# EAGLE design pov_brico (EAGLE 5.11)
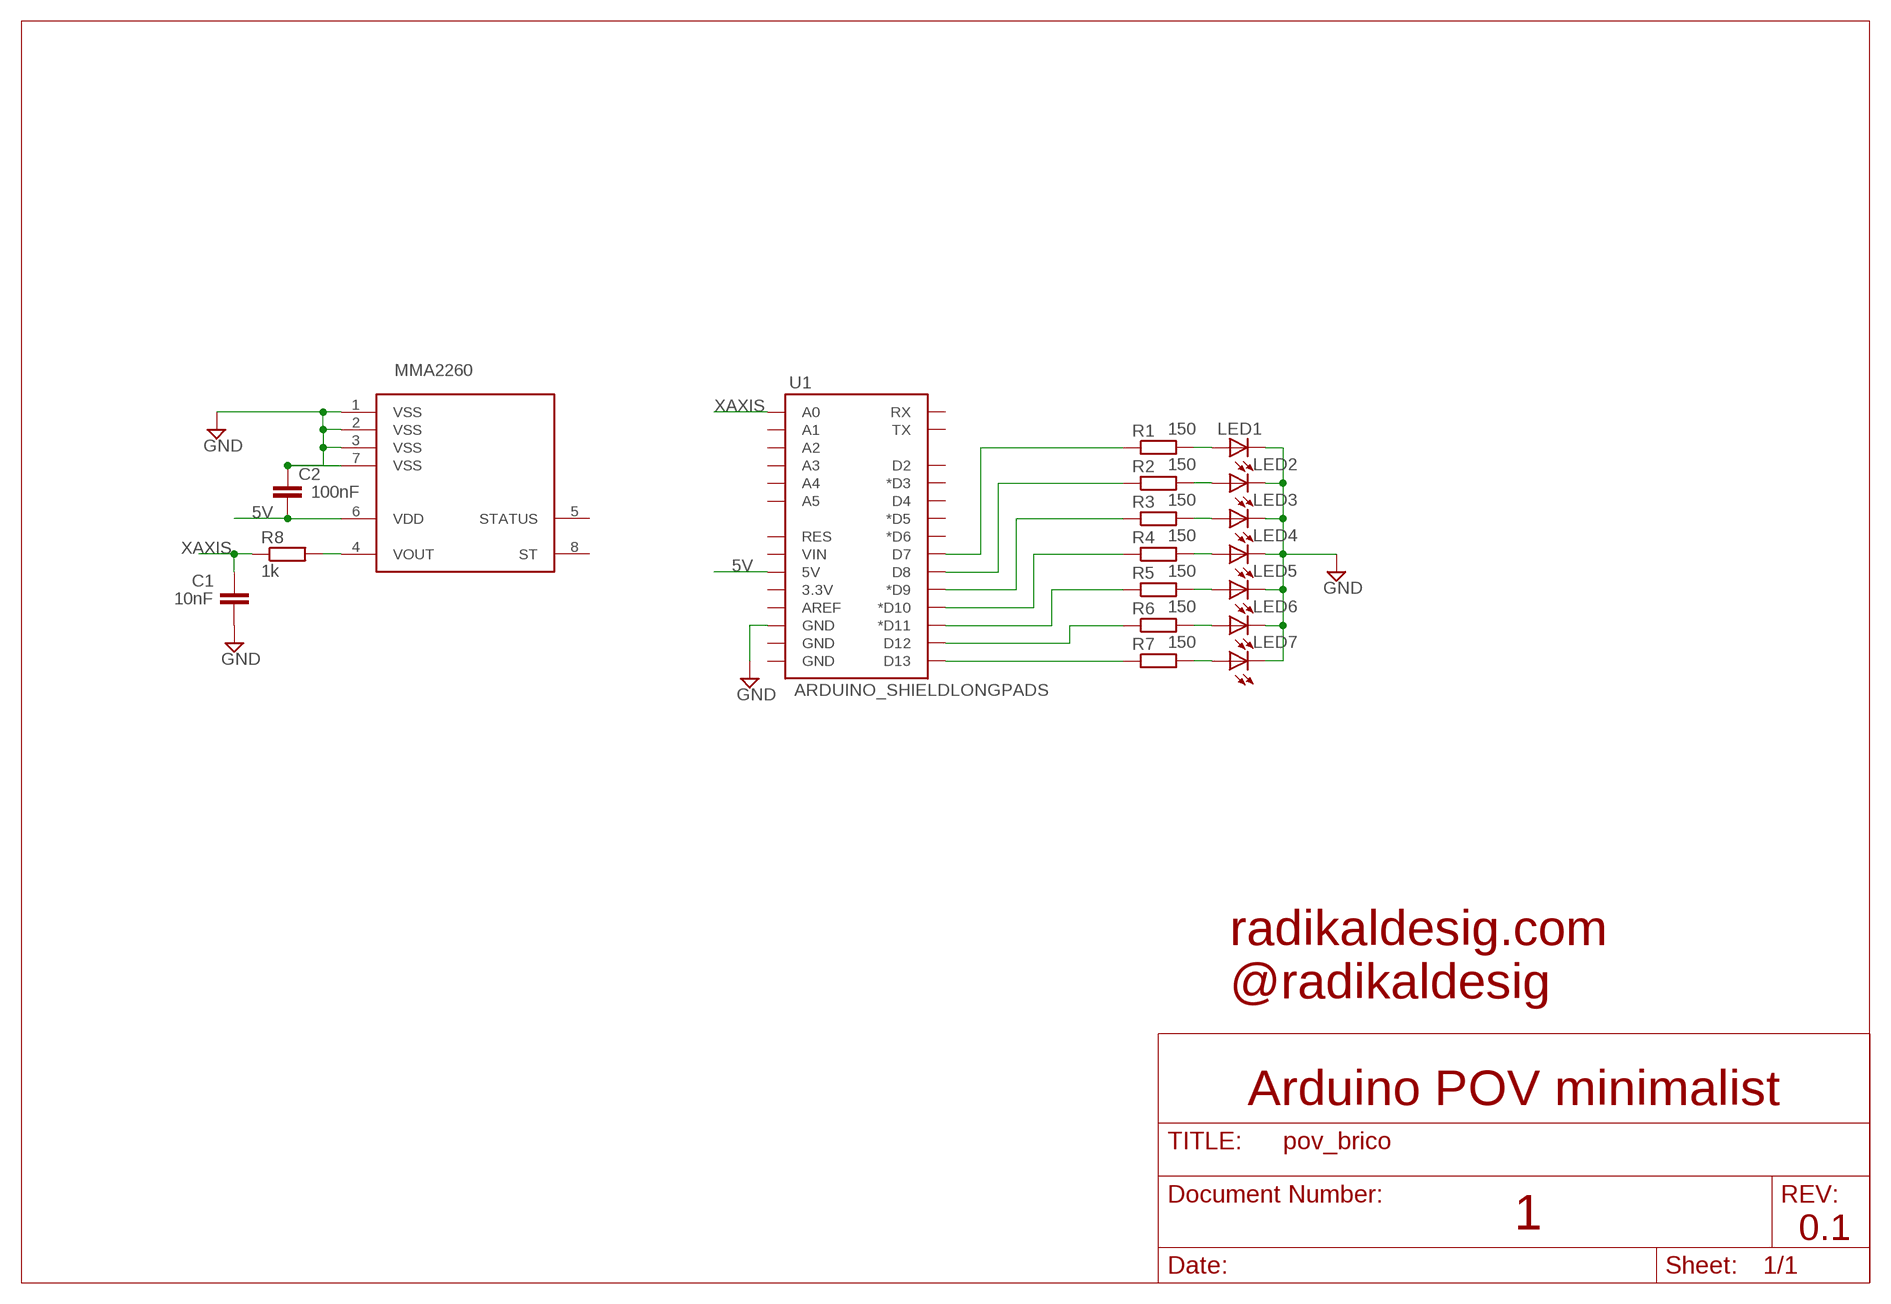
[diagram p0: schematic, sheet 1]

## Parts
C1  10nF  CAP1206  [1206]
C2  100nF  CAP1206  [1206]
LED1  LED5MM  [LED5MM]
LED2  LED5MM  [LED5MM]
LED3  LED5MM  [LED5MM]
LED4  LED5MM  [LED5MM]
LED5  LED5MM  [LED5MM]
LED6  LED5MM  [LED5MM]
LED7  LED5MM  [LED5MM]
R1  150  R-EU_R1206W  [R1206W]
R2  150  R-EU_R1206W  [R1206W]
R3  150  R-EU_R1206W  [R1206W]
R4  150  R-EU_R1206W  [R1206W]
R5  150  R-EU_R1206W  [R1206W]
R6  150  R-EU_R1206W  [R1206W]
R7  150  R-EU_R1206W  [R1206W]
R8  1k  R-EU_R1206W  [R1206W]
U1  ARDUINO_SHIELDLONGPADS  [DUEMILANOVE_SHIELD_LONGPADS]
U$1  MMA2260  [SO-16DW]

## Nets
5V: C2.2 U1.5V U$1.6(VDD)
GND: C1.2 C2.1 LED1.K(C) LED2.K(C) LED3.K(C) LED4.K(C) LED5.K(C) LED6.K(C) LED7.K(C) U1.GND@2(GND) U$1.1(VSS) U$1.2(VSS) U$1.3(VSS) U$1.7(VSS)
N$1: LED1.A R1.2
N$2: LED2.A R2.2
N$3: LED3.A R3.2
N$4: LED4.A R4.2
N$5: LED5.A R5.2
N$6: LED6.A R6.2
N$7: LED7.A R7.2
N$8: R8.2 U$1.4(VOUT)
N$9: R1.1 U1.D7
N$10: R2.1 U1.D8
N$11: R3.1 U1.D9(*D9)
N$12: R4.1 U1.D10(*D10)
N$13: R5.1 U1.D11(*D11)
N$14: R6.1 U1.D12
N$15: R7.1 U1.D13
XAXIS: C1.1 R8.1 U1.A0
Unconnected: U1.3.3V U1.A1 U1.A2 U1.A3 U1.A4 U1.A5 U1.AREF U1.D2 U1.D3(*D3) U1.D4 U1.D5(*D5) U1.D6(*D6) U1.GND@0(GND) U1.GND@1(GND) U1.RES U1.RX U1.TX U1.VIN U$1.5(STATUS) U$1.8(ST) U$1.9(NC) U$1.10(NC) U$1.11(NC) U$1.12(NC) U$1.13(NC) U$1.14(NC) U$1.15(NC) U$1.16(NC)

## Notes on the sheet
- MMA2260
- radikaldesig.com
- @radikaldesig
- Arduino POV minimalist
- 1
- 0.1

## Library data of the parts
C1 C2 = SparkFun:CAP: Capacitor Standard 0603 ceramic capacitor, and 0.1" leaded capacitor.
LED1-LED7 = SparkFun:LED: LEDs Standard schematic elements and footprints for 5mm, 3mm, 1206, and 0603 sized LEDs. 5mm - Spark Fun Electronics SKU : COM-00529 (and others)
R1-R8 = resistor:R-EU_: RESISTOR, European symbol
U1 = SparkFun:ARDUINO_SHIELD
U$1 = personal:MMA2260

## Board
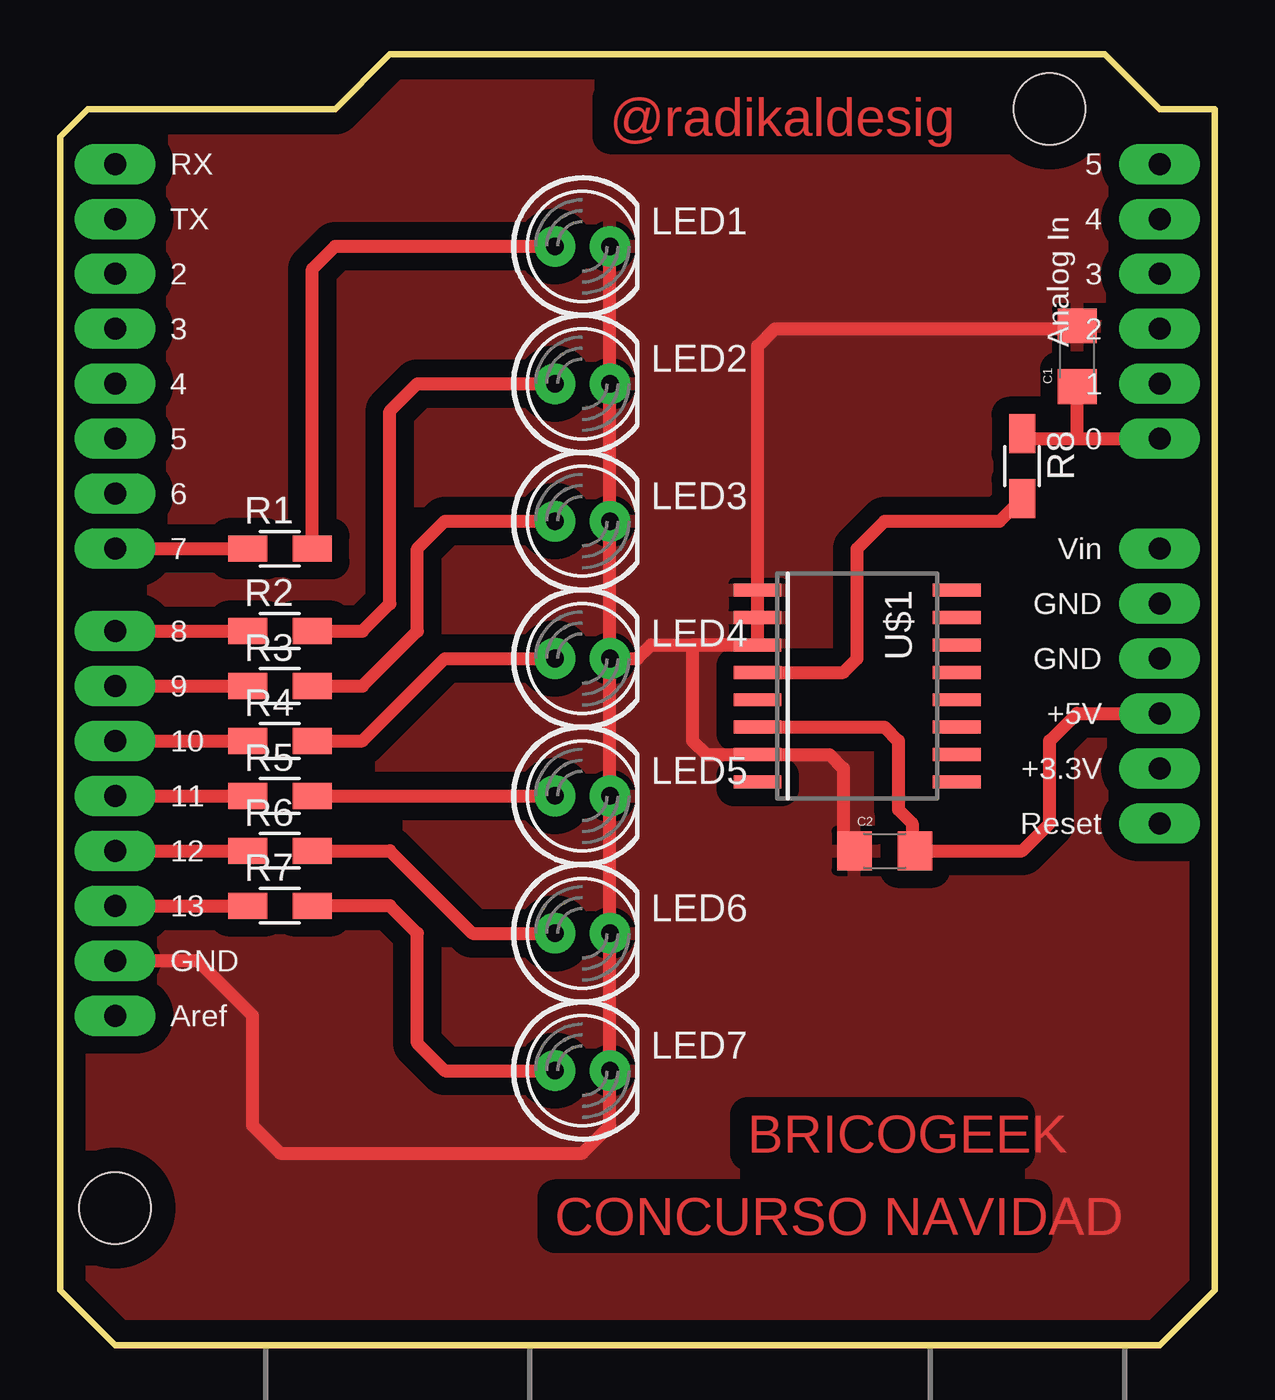
[diagram p1: board, top side]

Size 53.34 x 59.69 mm. Coordinates in mm from the lower left corner, seen from the top.
Outline: 0,55.88 1.27,57.15 12.7,57.15 15.24,59.69 48.26,59.69 50.8,57.15 53.34,57.15 53.34,2.54 50.8,0 2.54,0 0,2.54 0,55.88
Copper layers (1*16): Top 0.035mm / dielectric 1.5mm / Bottom 0.035mm
Design rules "default": minimum track width 10mil, minimum drill 24mil, track to track 8mil, track to pad 8mil, pad to pad 8mil, via to via 8mil, smd to smd 8mil, copper to edge 40mil, drill to drill 8mil, minimum pad ring 10mil, minimum via ring 8mil, stop-mask expansion 4mil, vias tented up to drill 0mil, thermal gap 10mil

### Footprints (pad centres in the part's own frame; a part is rotated, then mirrored left to right if it is on the bottom)
1206 = smd 1.6 x 1.8: 1 -1.4,0; 2 1.4,0
LED5MM = drill 0.813 pad 1.88 round: A -1.27,0; K 1.27,0
R1206W = smd 1.8 x 1.2: 1 -1.499,0; 2 1.499,0
DUEMILANOVE_SHIELD_LONGPADS = drill 1.016 pad 1.88 long: 3.3V 50.8,26.67; 5V 50.8,29.21; A0 50.8,41.91; A1 50.8,44.45; A2 50.8,46.99; A3 50.8,49.53; A4 50.8,52.07; A5 50.8,54.61; AREF 2.54,15.24; D2 2.54,49.53; D3 2.54,46.99; D4 2.54,44.45; D5 2.54,41.91; D6 2.54,39.37; D7 2.54,36.83; D8 2.54,33.02; D9 2.54,30.48; D10 2.54,27.94; D11 2.54,25.4; D12 2.54,22.86; D13 2.54,20.32; GND@0 50.8,31.75; GND@1 50.8,34.29; GND@2 2.54,17.78; RES 50.8,24.13; RX 2.54,54.61; TX 2.54,52.07; VIN 50.8,36.83 | hole 3.302: 45.72,57.15; 2.54,6.35
SO-16DW = smd 0.6 x 2.2: 1 -4.445,-4.6; 2 -3.175,-4.6; 3 -1.905,-4.6; 4 -0.635,-4.6; 5 0.635,-4.6; 6 1.905,-4.6; 7 3.175,-4.6; 8 4.445,-4.6; 9 4.445,4.6; 10 3.175,4.6; 11 1.905,4.6; 12 0.635,4.6; 13 -0.635,4.6; 14 -1.905,4.6; 15 -3.175,4.6; 16 -4.445,4.6

### Placement (x,y rotation side)
C1  46.99,45.72 90 top
C2  38.1,22.86 0 top
LED1  24.13,50.8 0 top
LED2  24.13,44.45 0 top
LED3  24.13,38.1 0 top
LED4  24.13,31.75 0 top
LED5  24.13,25.4 0 top
LED6  24.13,19.05 0 top
LED7  24.13,12.7 0 top
R1  10.16,36.83 0 top
R2  10.16,33.02 0 top
R3  10.16,30.48 0 top
R4  10.16,27.94 0 top
R5  10.16,25.4 0 top
R6  10.16,22.86 0 top
R7  10.16,20.32 0 top
R8  44.45,40.64 270 top
U1  0,0 0 top
U$1  36.83,30.48 270 top

### Tracks (layer width: path | path; a pad name or v marks a point on that pad's centre or on a via)
5V
  Top 0.61: U$1.6 38.1,28.57 38.73,27.94 38.73,24.77 39.37,24.13 39.37,22.99 C2.2 44.45,22.86 45.72,24.13 45.72,27.94 46.99,29.21 U1.5V
GND
  Top 0.61: LED1.K LED2.K LED3.K LED4.K | LED4.K LED5.K LED6.K LED7.K 25.4,10.16 24.13,8.89 10.16,8.89 8.89,10.16 8.89,15.24 6.35,17.78 U1.GND@2 | U$1.3 27.3,32.38 26.67,31.75 LED4.K | U$1.3 U$1.2 U$1.1 32.23,46.2 33.02,46.99 46.86,46.99 C1.2 | U$1.3 29.21,32.38 29.21,27.94 29.84,27.3 U$1.7 35.56,27.3 36.2,26.67 36.2,23.36 C2.1
  pour Top (isolate 0.813): -1.27,60.96 54.61,60.96 54.61,-1.27 -1.27,-1.27
N$1
  Top 0.61: R1.2 11.66,49.76 12.7,50.8 LED1.A
N$2
  Top 0.61: R2.2 13.97,33.02 15.24,34.29 15.24,43.18 16.51,44.45 LED2.A
N$3
  Top 0.61: R3.2 13.97,30.48 16.51,33.02 16.51,36.83 17.78,38.1 LED3.A
N$4
  Top 0.61: R4.2 13.97,27.94 17.78,31.75 LED4.A
N$5
  Top 0.61: R5.2 LED5.A
N$6
  Top 0.61: R6.2 15.24,22.86 19.05,19.05 LED6.A
N$7
  Top 0.61: R7.2 15.24,20.32 16.51,19.05 16.51,13.97 17.78,12.7 LED7.A
N$8
  Top 0.61: U$1.4 36.2,31.11 36.83,31.75 36.83,36.83 38.1,38.1 43.41,38.1 R8.2
N$9
  Top 0.61: U1.D7 R1.1
N$10
  Top 0.61: U1.D8 R2.1
N$11
  Top 0.61: U1.D9 R3.1
N$12
  Top 0.61: U1.D10 R4.1 8.89,27.94
N$13
  Top 0.61: U1.D11 R5.1
N$14
  Top 0.61: U1.D12 R6.1
N$15
  Top 0.61: U1.D13 R7.1
XAXIS
  Top 0.61: 46.99,41.91 44.68,41.91 R8.1 | 46.99,41.91 U1.A0 | 46.99,41.91 C1.1

### Text on the board
Top: @radikaldesig | BRICOGEEK | CONCURSO NAVIDAD